# Altium project TugasAkhir.PrjPcb
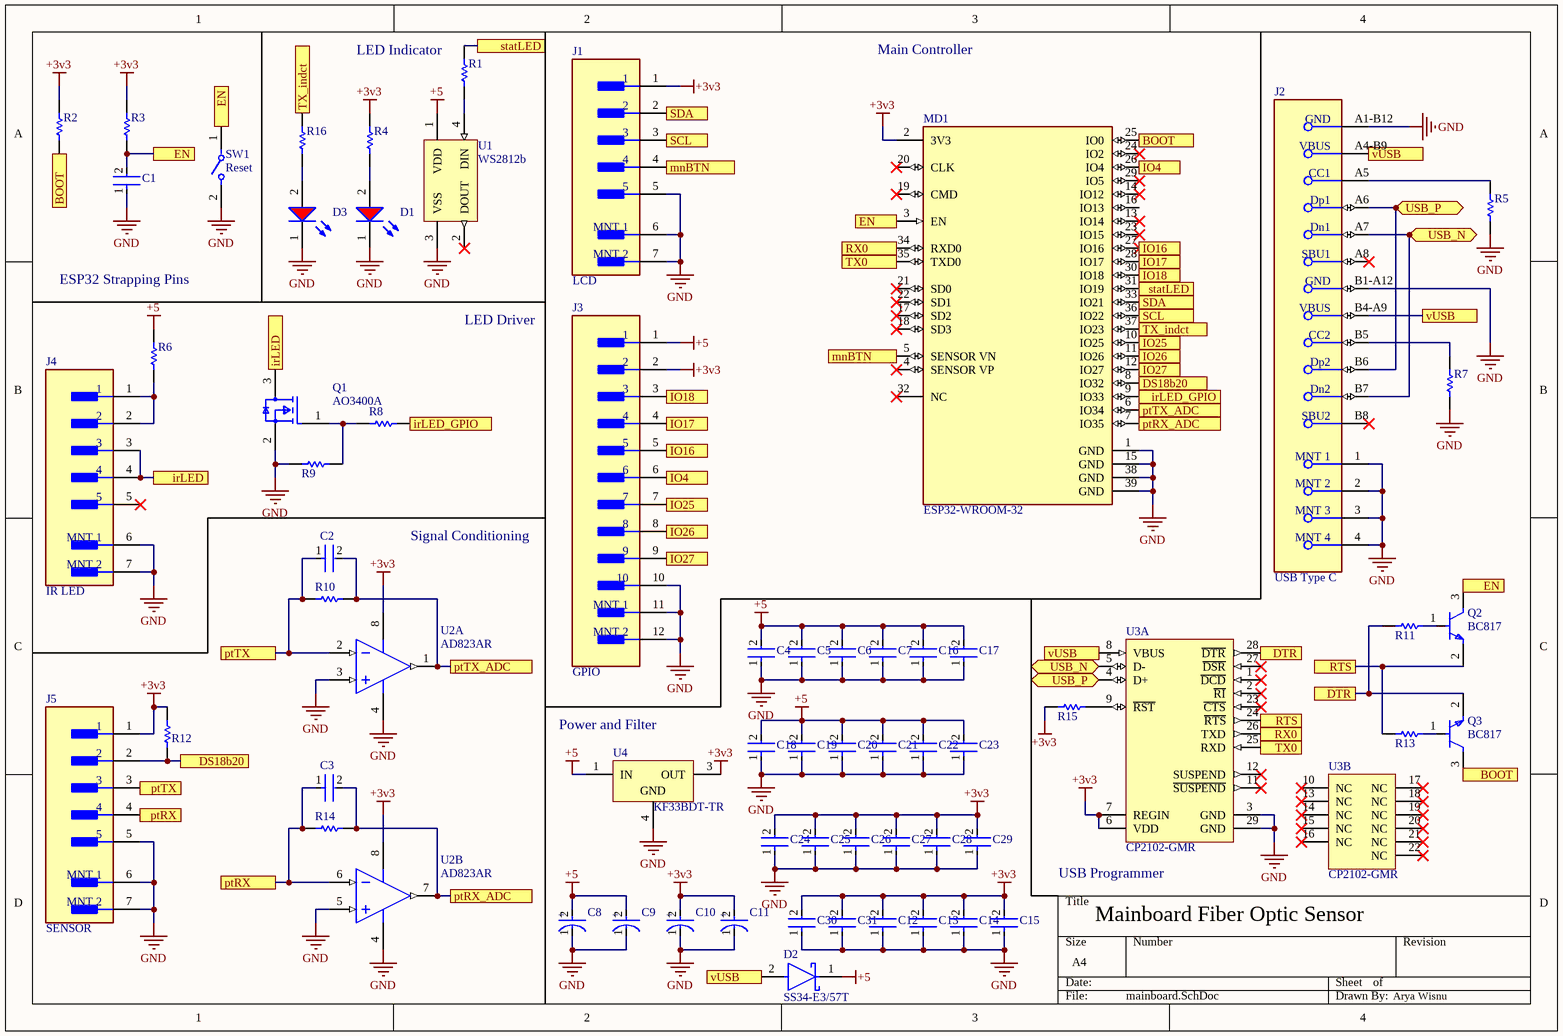
[diagram p0: mainboard.SchDoc]
1 sheet, 64 parts. Net scope: flat (ports and power ports of the same name join across sheets).
Board file: mainboard.PcbDoc

## Sheet mainboard.SchDoc
size A4; SheetNumber: 1; SheetTotal: 1

### Parts
C1  GRM21BR61E106KA73L  [FP-GRM21B-0_15-IPC_B]  (value not drawn)
C2  GRM21BR61E106KA73L  [FP-GRM21B-0_15-IPC_B]  (value not drawn)
C3  GRM21BR61E106KA73L  [FP-GRM21B-0_15-IPC_B]  (value not drawn)
C4  GRM21BR61E106KA73L  [FP-GRM21B-0_15-IPC_B]  (value not drawn)
C5  GRM21BR61E106KA73L  [FP-GRM21B-0_15-IPC_B]  (value not drawn)
C6  GRM21BR61E106KA73L  [FP-GRM21B-0_15-IPC_B]  (value not drawn)
C7  GRM21BR61E106KA73L  [FP-GRM21B-0_15-IPC_B]  (value not drawn)
C8  T491B106K016AT  [FP-T491B106K016AT-MFG]  (value not drawn)
C9  T491B106K016AT  [FP-T491B106K016AT-MFG]  (value not drawn)
C10  T491B106K016AT  [FP-T491B106K016AT-MFG]  (value not drawn)
C11  T491B106K016AT  [FP-T491B106K016AT-MFG]  (value not drawn)
C12  GRM21BR61E106KA73L  [FP-GRM21B-0_15-IPC_B]  (value not drawn)
C13  GRM21BR61E106KA73L  [FP-GRM21B-0_15-IPC_B]  (value not drawn)
C14  GRM21BR61E106KA73L  [FP-GRM21B-0_15-IPC_B]  (value not drawn)
C15  GRM21BR61E106KA73L  [FP-GRM21B-0_15-IPC_B]  (value not drawn)
C16  GRM21BR61E106KA73L  [FP-GRM21B-0_15-IPC_B]  (value not drawn)
C17  GRM21BR61E106KA73L  [FP-GRM21B-0_15-IPC_B]  (value not drawn)
C18  GRM21BR61E106KA73L  [FP-GRM21B-0_15-IPC_B]  (value not drawn)
C19  GRM21BR61E106KA73L  [FP-GRM21B-0_15-IPC_B]  (value not drawn)
C20  GRM21BR61E106KA73L  [FP-GRM21B-0_15-IPC_B]  (value not drawn)
C21  GRM21BR61E106KA73L  [FP-GRM21B-0_15-IPC_B]  (value not drawn)
C22  GRM21BR61E106KA73L  [FP-GRM21B-0_15-IPC_B]  (value not drawn)
C23  GRM21BR61E106KA73L  [FP-GRM21B-0_15-IPC_B]  (value not drawn)
C24  GRM21BR61E106KA73L  [FP-GRM21B-0_15-IPC_B]  (value not drawn)
C25  GRM21BR61E106KA73L  [FP-GRM21B-0_15-IPC_B]  (value not drawn)
C26  GRM21BR61E106KA73L  [FP-GRM21B-0_15-IPC_B]  (value not drawn)
C27  GRM21BR61E106KA73L  [FP-GRM21B-0_15-IPC_B]  (value not drawn)
C28  GRM21BR61E106KA73L  [FP-GRM21B-0_15-IPC_B]  (value not drawn)
C29  GRM21BR61E106KA73L  [FP-GRM21B-0_15-IPC_B]  (value not drawn)
C30  GRM21BR61E106KA73L  [FP-GRM21B-0_15-IPC_B]  (value not drawn)
C31  GRM21BR61E106KA73L  [FP-GRM21B-0_15-IPC_B]  (value not drawn)
D1  150080SS75000  [WL-SMCW_0805_150080xx75000]  (value not drawn)
D2  SS34-E3/57T  [FP-95402-MFG]
D3  150080SS75000  [WL-SMCW_0805_150080xx75000]  (value not drawn)
J1  LCD  [FP-SM05B-SRSS-G-TB_LF_SN-MFG]
J2  USB Type C  [FP-USB4105-GF-A-MFG]
J3  GPIO  [FP-BM10B-SRSS-TBT_LF_SN-MFG]
J4  IR LED  [FP-SM05B-SRSS-G-TB_LF_SN-MFG]
J5  SENSOR  [FP-SM05B-SRSS-G-TB_LF_SN-MFG]
MD1  ESP32-WROOM-32  [FP-ESP32-WROOM-32-MFG]
Q1  AO3400A  [FP-SOT23-MFG]
Q2  BC817  [FP-SOT23-MFG]
Q3  BC817  [FP-SOT23-MFG]
R1  ERA6AEB472V  [RESC2013X60X40ML20T25]  (value not drawn)
R2  ERA6AEB472V  [RESC2013X60X40ML20T25]  (value not drawn)
R3  ERA6AEB472V  [RESC2013X60X40ML20T25]  (value not drawn)
R4  ERA6AEB472V  [RESC2013X60X40ML20T25]  (value not drawn)
R5  ERA6AEB472V  [RESC2013X60X40ML20T25]  (value not drawn)
R6  ERA6AEB472V  [RESC2013X60X40ML20T25]  (value not drawn)
R7  ERA6AEB472V  [RESC2013X60X40ML20T25]  (value not drawn)
R8  ERA6AEB472V  [RESC2013X60X40ML20T25]  (value not drawn)
R9  ERA6AEB472V  [RESC2013X60X40ML20T25]  (value not drawn)
R10  ERA6AEB472V  [RESC2013X60X40ML20T25]  (value not drawn)
R11  ERA6AEB472V  [RESC2013X60X40ML20T25]  (value not drawn)
R12  ERA6AEB472V  [RESC2013X60X40ML20T25]  (value not drawn)
R13  ERA6AEB472V  [RESC2013X60X40ML20T25]  (value not drawn)
R14  ERA6AEB472V  [RESC2013X60X40ML20T25]  (value not drawn)
R15  ERA6AEB472V  [RESC2013X60X40ML20T25]  (value not drawn)
R16  ERA6AEB472V  [RESC2013X60X40ML20T25]  (value not drawn)
SW1  Reset  [FP-147873-1-MFG]
U1  WS2812b  [ADA-RGB-1655_V]
U2  AD823AR  [ADI-R-8_L]  (parts A,B of 2)
U3  CP2102-GMR  [SLAB-QFN-28-3125x3125TP_M]  (parts A,B of 2)
U4  KF33BDT-TR  [TO-252_M]

### Ports
BOOT, DS18b20, DTR, EN, IO4, IO16, IO17, IO18, IO25, IO26, IO27, irLED, irLED_GPIO, mnBTN, ptRX, ptRX_ADC, ptTX, ptTX_ADC, RTS, RX0, SCL, SDA, statLED, TX0, TX_indct, USB_N (bidir), USB_P (bidir), vUSB

### Nets
+3v3: C10.2(A) C11.2(A) C12.2 C13.2 C14.2 C15.2 C24.2 C25.2 C26.2 C27.2 C28.2 C29.2 C30.2 C31.2 J1.1 J3.2 J5.1 MD1.2(3V3) R2.2 R3.2 R4.2 R12.2 R15.1 U2.8(+VS) U3.6(VDD) U3.7(REGIN) U4.3(OUT)
+5: C4.2 C5.2 C6.2 C7.2 C8.2(A) C9.2(A) C16.2 C17.2 C18.2 C19.2 C20.2 C21.2 C22.2 C23.2 D2.1(C) J3.1 R6.2 U1.1(VDD) U4.1(IN)
GND: C1.1 C4.1 C5.1 C6.1 C7.1 C8.1(C) C9.1(C) C10.1(C) C11.1(C) C12.1 C13.1 C14.1 C15.1 C16.1 C17.1 C18.1 C19.1 C20.1 C21.1 C22.1 C23.1 C24.1 C25.1 C26.1 C27.1 C28.1 C29.1 C30.1 C31.1 D1.1(K) D3.1(K) J1.5 J1.6(MNT_1) J1.7(MNT_2) J2.1(MNT_1) J2.2(MNT_2) J2.3(MNT_3) J2.4(MNT_4) J2.A1-B12(GND) J2.B1-A12(GND) J3.10 J3.11(MNT_1) J3.12(MNT_2) J4.6(MNT_1) J4.7(MNT_2) J5.5 J5.6(MNT_1) J5.7(MNT_2) MD1.1(GND) MD1.15(GND) MD1.38(GND) MD1.39(GND) Q1.2(S) R5.1 R7.1 R9.2 SW1.2 U1.3(VSS) U2.3(+IN_1) U2.4(-VS) U2.5(+IN_2) U3.3(GND) U3.29(GND) U4.4(GND)
NetC1_2: C1.2 MD1.3(EN) Q2.3(C) R3.1 SW1.1 ; port EN
NetC2_1: C2.1 J5.3 R10.1 U2.2(-IN_1) ; port ptTX
NetC2_2: C2.2 MD1.6(IO34) R10.2 U2.1(OUT_1) ; port ptTX_ADC
NetC3_1: C3.1 J5.4 R14.1 U2.6(-IN_2) ; port ptRX
NetC3_2: C3.2 MD1.7(IO35) R14.2 U2.7(OUT_2) ; port ptRX_ADC
NetD1_2: D1.2(A) R4.1
NetD2_2: D2.2(A) J2.A4-B9(VBUS) J2.B4-A9(VBUS) U3.8(VBUS) ; port vUSB
NetD3_2: D3.2(A) R16.1
NetJ1_2: J1.2 MD1.33(IO21) ; port SDA
NetJ1_3: J1.3 MD1.36(IO22) ; port SCL
NetJ1_4: J1.4 MD1.5(SENSOR_VN) ; port mnBTN
NetJ2_A5: J2.A5(CC1) R5.2
NetJ2_A6: J2.A6(Dp1) J2.B6(Dp2) U3.4(D+) ; port USB_P
NetJ2_A7: J2.A7(Dn1) J2.B7(Dn2) U3.5(D-) ; port USB_N
NetJ2_B5: J2.B5(CC2) R7.2
NetJ3_3: J3.3 MD1.30(IO18) ; port IO18
NetJ3_4: J3.4 MD1.28(IO17) ; port IO17
NetJ3_5: J3.5 MD1.27(IO16) ; port IO16
NetJ3_6: J3.6 MD1.26(IO4) ; port IO4
NetJ3_7: J3.7 MD1.10(IO25) ; port IO25
NetJ3_8: J3.8 MD1.11(IO26) ; port IO26
NetJ3_9: J3.9 MD1.12(IO27) ; port IO27
NetJ4_1: J4.1 J4.2 R6.1
NetJ4_3: J4.3 J4.4 Q1.3(D) ; port irLED
NetJ5_2: J5.2 MD1.8(IO32) R12.1 ; port DS18b20
NetMD1_9: MD1.9(IO33) R8.2 ; port irLED_GPIO
NetMD1_25: MD1.25(IO0) Q3.3(C) R2.1 ; port BOOT
NetMD1_31: MD1.31(IO19) R1.2 ; port statLED
NetMD1_34: MD1.34(RXD0) U3.26(TXD) ; port RX0
NetMD1_35: MD1.35(TXD0) U3.25(RXD) ; port TX0
NetMD1_37: MD1.37(IO23) R16.2 ; port TX_indct
NetQ1_1: Q1.1(G) R8.1 R9.1
NetQ2_1: Q2.1(B) R11.1
NetQ2_2: Q2.2(E) R13.2 U3.24(~{RTS}) ; port RTS
NetQ3_1: Q3.1(B) R13.1
NetQ3_2: Q3.2(E) R11.2 U3.28(~{DTR}) ; port DTR
NetR1_1: R1.1 U1.4(DIN)
NetR15_2: R15.2 U3.9(~{RST})

Not connected (* = marked no-connect by the designer): J2 A8(SBU1)* B8(SBU2)*; J4 5*; MD1 4(SENSOR_VP)* 13(IO14)* 14(IO12)* 16(IO13) 17(SD2)* 18(SD3)* 19(CMD)* 20(CLK)* 21(SD0)* 22(SD1)* 23(IO15)* 24(IO2)* 29(IO5)* 32(NC)*; U1 2(DOUT)*; U3 1(~{DCD})* 2(~{RI})* 10(NC)* 11(~{SUSPEND})* 12(SUSPEND)* 13(NC)* 14(NC)* 15(NC)* 16(NC)* 17(NC)* 18(NC)* 19(NC)* 20(NC)* 21(NC)* 22(NC)* 23(~{CTS})* 27(~{DSR})*

### Notes on the sheet
- (near R1) LED Indicator
- Main Controller
- ESP32 Strapping Pins
- LED Driver
- Signal Conditioning
- (near U4) Power and Filter
- (near U3) USB Programmer
- (near U3) Mainboard Fiber Optic Sensor
- Arya Wisnu
- (in symbol CMP-03017-000012-1) +

### Library data of the parts
C1-C7 C12-C31 = CMP-2007-03541-2: Chip Multilayer Ceramic Capacitors for General Purpose, 0805, 10uF, X5R, 15%, 10%, 25V; Length: 2mm; Depth: 1.25mm; Termination: SMD/SMT; Voltage: 25V; Height: 1.25mm; Material: Ceramic; Thickness: 0.053inch; Radiation Hardening: No; Min Operating Temperature: -55°C; Width: 0.049inch; Package Quantity: 1; Mount: Surface Mount; Dielectric: X5R; Packaging: Tape and Reel; Capacitance: 10uF; Voltage Rating (DC): 25V; Lead Free: Lead Free; Max Operating Temperature: 85°C; Case Code (Imperial): 0805; Case/Package: 0805; Tolerance: 10%; Voltage Rating: 25V; Case Code (Metric): 2012
C8-C11 = CMP-03017-000012-1: CAP TANT 10UF 10% 16V 1411; Dissipation Factor: 6%; ESR (Equivalent Series Resistance): 2.8R; Ripple Current: 174mA; Dielectric Material: Tantalum; Leakage Current: 1.6uA; Polarity: Polar; Life (Hours): 2000Hour; Case/Package: 1411; Height - Seated (Max): 0.083inch; Case Code (Metric): 3528; Height: 1.9mm; Packaging: Tape and Reel; RoHS Compliant: Yes; Voltage Rating (DC): 16V; Tolerance: 10%; Lead Pitch: 1.9mm; Min Operating Temperature: -55°C; Package Quantity: 1; Capacitance: 10uF; Mount: Surface Mount; Length: 3.5mm; Max Operating Temperature: 125°C; Number of Pins: 2; Voltage: 16V; Voltage Rating: 16V; Termination: SMD/SMT; Depth: 2.8mm; Lead Free: Lead Free; REACH SVHC: No SVHC; Case Code (Imperial): 1411; Width: 0.11inch; Features: General Purpose
D1 D3 = CMP-1426-00010-3: NexarPartId: 29717782; Peak Wavelength: 645nm; Luminous Intensity: 60mcd; Max Junction Temperature (Tj): 95°C; Wavelength: 630nm; Forward Current: 100mA; Max Reverse Voltage (DC): 5V; Color: Red; Lens Style: Clear, Rectangular; Test Current: 20mA; Power Dissipation: 72mW; Viewing Angle: 140°; Forward Voltage: 1.9V; Case Code (Metric): 2012; Max Operating Temperature: 85°C; Mount: Surface Mount; Height: 700µm; Case/Package: 0805; Min Operating Temperature: -40°C; Reverse Voltage: 5V; RoHS: Compliant; Packaging: Tape and Reel; REACH SVHC: Unknown; Case Code (Imperial): 0805; Length: 2mm; Width: 1.25mm; Dominant Wavelength: 630nm
D2 = CMP-02539-000012-1: DIODE SCHOTTKY 40V 3A DO214AB; Manufacturer: Vishay; Max Junction Temp: +150°C; Peak Reverse Current: 0.5mA; Max Surge Forward Current: 100A; Standoff Height: 0mm; ComponentLink2Description: Datasheet; Device Class L3: Schottky Diodes; Height: 2.62mm; Max Repetitive Reverse Voltage: 40V; Lead Free: Yes; Package: 95402; Temperature Range High: +150°C; ComponentLink2URL: http://www.vishay.com/docs/88751/ss32.pdf; Temperature: -55°C to +150°C; Footprint Url: http://www.vishay.com/docs/95402/smc.pdf; Automotive: No; Forward Current: 3A; Category: Diode; Manufacturer Part Number: SS34-E3/57T; RoHS: TRUE; Device Class L2: Diodes; Mouser Description: Schottky Diodes & Rectifiers 3.0 Amp 40 Volt; Octopart: https://octopart.com/ss34-e3%2F57t-vishay-39552907; Temperature Range Low: -55°C; Device Class L1: Discrete Semiconductors; Digikey Description: DIODE SCHOTTKY 40V 3A DO214AB
J1 J4 J5 = CMP-17439-000344-1: CONN HEADER SMD R/A 5POS 1MM; Connector Type: Male Pin; Pitch: 0.039inch; Number of Positions: 5; Lead Free: Lead Free; Contact Plating: Tin; Mount: Surface Mount; Number of Pins: 5; Contact Type: Male Pin; Packaging: Tape and Reel; Number of Rows: 1; Termination: Solder; Series: SR
J2 = CMP-245163-000001-1: CONN RCPT USB2.0 TYPEC 5A; Manufacturer Part Number: USB4105-GF-A; Manufacturer: GCT; Voltage Rating: 20V; Is Female: yes; Current Rating: 5/6.25/1.25/0.25A; Number Of Contacts: 16; Conn Orientation: Right Angle; Device Class L1: Connectors; Category: Conn; Lead Free: Yes; RoHS: TRUE; Temperature Range High: +85°C; Digikey Description: CONN RCPT USB2.0 TYPEC 5A; Device Class L3: unset; ComponentLink2Description: Datasheet; Package: 0; Usb Standard: USB 2.0; Device Class L2: USB Connectors; Automotive: No; Temperature Range Low: -40°C; Height: 3.46mm; Temperature: -40°C to +85°C; Contact Material: Gold,Nickel; ComponentLink2URL: https://gct.co/files/drawings/usb4105.pdf; Octopart: https://octopart.com/usb4105-gf-a-gct-106627878
J3 = CMP-17439-000586-1: CONN HEADER SMD 10POS 1MM; Number of Positions: 10; Lead Free: Lead Free; Pitch: 1mm; Termination: Crimp
MD1 = CMP-194065-000008-1: RX TXRX MOD WIFI SURFACE MOUNT; Frequency: 2.5GHz; Sensitivity: -98dBm; Operating Supply Voltage: 3.6V; Data Rate: 150Mbps; Weight: 0.088185oz; Package Quantity: 550; Min Operating Temperature: -40°C; Mount: Surface Mount; Max Operating Temperature: 85°C; Packaging: Cut Tape; Case/Package: SMD/SMT
Q1 = CMP-83955-000006-1: MOSFET N-CH 30V 5.7A SOT23; Input Capacitance: 630pF; Number of Elements: 1; Rds On Max: 26.5mR; Max Power Dissipation: 1.4W; Gate to Source Voltage (Vgs): 12V; Min Operating Temperature: -55°C; Lead Free: Lead Free; Number of Pins: 3; Drain to Source Voltage (Vdss): 30V; Case/Package: SOT-23; Mount: Surface Mount; Continuous Drain Current (ID): 5.7A; Radiation Hardening: No; Packaging: Tape and Reel; Max Operating Temperature: 150°C; Power Dissipation: 1.4W
Q2 Q3 = CMP-14406-000007-1: TRANS NPN 45V 0.5A SOT23; Manufacturer Part Number: BC817-40,215; Manufacturer: Nexperia; Collector Emitter Saturation Voltage: 700mV; Power Dissipation: 250mW; Collector Base Voltage: 50V; Unity Gain Freq: 100MHz; Hfe Max: 600; Rthja Max: 500K/W; Emitter Base Voltage: 5V; Max Collector Current: 500mA; Hfe Testvce: 1V; Automotive Grade: Grade 0; Hfe Min: 250; Max Junction Temp: +150°C; Number Of Npn: 1; Hfe Testic: 100mA; Octopart: https://octopart.com/bc817-40%2C215-nexperia-78739081; Lead Free: Yes; Ipc Land Pattern Name: SOT95P230X100-3; RoHS: TRUE; Collector Emitter Breakdown Voltage: 45V; Digikey Description: TRANS NPN 45V 0.5A SOT23; ComponentLink2URL: https://assets.nexperia.com/documents/data-sheet/BC817_SER.pdf; Temperature Range High: +150°C; Mouser Description: BC817 Series 45 V 500 mA 250 mW SMT NPN General-Purpose Transistor - SOT-23-; Device Class L3: BJTs; Temperature: to +150°C; Height: 1.1mm; Automotive: Yes; Ambient Temperature Range Low: -65°C; Package: SOT23; Collector Emitter Voltage: 45V; Category: Trans; ComponentLink2Description: Datasheet; Device Class L2: Transistors; Ambient Temperature Range High: +150°C; Number Of Elements: 1; Device Class L1: Discrete Semiconductors; Footprint Url: https://assets.nexperia.com/documents/outline-drawing/SOT23.pdf
R1 R4 R16 = CMP-2001-00644-1: 330ohm; Manufacturer: Panasonic; Part Number: ERA6AEB472V
R2 R3 R9 R11 R13 = CMP-2001-00644-1: 10k; Manufacturer: Panasonic; Part Number: ERA6AEB472V
R5 R7 = CMP-2001-00644-1: 5k1; Manufacturer: Panasonic; Part Number: ERA6AEB472V
R6 = CMP-2001-00644-1: Manufacturer: Panasonic; Part Number: ERA6AEB472V
R8 = CMP-2001-00644-1: 100ohm; Manufacturer: Panasonic; Part Number: ERA6AEB472V
R10 R14 = CMP-2001-00644-1: 50k; Manufacturer: Panasonic; Part Number: ERA6AEB472V
R12 R15 = CMP-2001-00644-1: 4k7; Manufacturer: Panasonic; Part Number: ERA6AEB472V
SW1 = CMP-03407-000005-1: SWITCH TACTILE SPST-NO 0.05A 24V; Manufacturer: TE Connectivity; Manufacturer Part Number: 147873-1; Contact Resistance: 100mΩ; Operating Force: 180gf; Electromechanical Life: 40000Cycles; Contact Current Rating: 50mA; Throw Configuration: SPST-NO; Mouser Description: Switch Tactile OFF (ON) SPST Rectangular Button J-Bend 0.05A 24VDC 1.77N SMD T/R; Mount: Surface Mount; Height: 5.5mm; Category: Switch; RoHS: TRUE; Temperature Range High: +85°C; ComponentLink2Description: Datasheet; Temperature Range Low: -35°C; Device Class L1: Electromechanical; Device Class L2: Switches; Package: 0; Temperature: -35°C to +85°C; Device Class L3: Tactile Switches; Automotive: No; ComponentLink2URL: https://www.te.com/commerce/DocumentDelivery/DDEController?Action=showdoc&DocId=Customer+Drawing%7F147873%7FK3%7Fpdf%7FEnglish%7FENG_CD_147873_K3.pdf%7F147873-1; Lead Free: Yes; Voltage Rating Dc: 24V; Octopart: https://octopart.com/147873-1-te+connectivity-40818451; Digikey Description: SWITCH TACTILE SPST-NO 0.05A 24V
U1 = CMP-2000-05026-1: Intelligent Control LED Integrated Light Source, 3.5 to 5.3 V, -25 to 80 degC, 4-Pin SMD, RoHS, Tape and Reel; Manufacturer: Adafruit-Industries-LLC; Number of LEDs: 10; Configuration: Discrete; Utilized LED: WS2812(5050); Datasheet URL: http://datasheet.octopart.com/ADA1655-Adafruit-Industries-datasheet-32028139.pdf; Series: Neopixel; Interface: -; Package Description: 4-Pin Surface Mount Device, Body 5 x 5 mm; Color: Red,Green,Blue(RGB); Category: Optoelectronics; Controller Type: -; Package Reference: 1655; Manufacturer URL: https://www.adafruit.com/; Mounting Type: SurfaceMount; Datasheet Version: May-13; Size / Dimension: 5.00mmLx5.00mmW; Family: Addressable,Specialty
U2 = CMP-0384-00939-1: Double Channel Rail-to-Rail Operational Amplifier, 16 MHz BW, 25 V/us SR, Industrial, 8-pin SOIC (R-8), Tube; Manufacturer: Analog Devices; Generic Part Number: AD823; V Span Max: 36V; Slew Rate: 25V/us; Small Signal Bandwidth: 16MHz; Amplifiers Per Package: 2; Input Bias Current: 5pA; Input Offset Voltage: 700uV; V Span Min: 3V; Iq/Amp: 4.2mA; ComponentLink1URL: http://www.analog.com/en/index.html; PartNumber: AD823AR; PackageReference: R-8; PackageVersion: 060506-A; PackageDescription: 8-Pin Standard Small Outline Package, Body 3.9 x 4.9 mm, Pitch 1.27 mm; ComponentLink2URL: http://www.analog.com/static/imported-files/data_sheets/AD823.pdf; Code_JEDEC: MS-012-AA; ComponentLink3Description: Package Specification; DatasheetVersion: Rev. E; Mounting Technology: Surface Mount; ComponentLink1Description: Manufacturer URL; ComponentLink3URL: http://www.analog.com/static/imported-files/packages/PKG_PDF/SOIC_Narrow%20(R)/R_8.pdf; ComponentLink2Description: Datasheet
U3 = CMP-2000-04924-1: Single-Chip USB to URAT Bridge, 3.3 V, -40 to 85 degC, 28-Pin QFN, RoHS, Tape and Reel; Manufacturer: Silicon Labs; Interface Circuit Standard 1: RS-232; Transmitter and Receiver FIFO Counter: No; Supply Current: 26mA; Operating Supply Voltage (Min): 3V; Operating Supply Voltage (Typ): 3.3V; Data Rate: 1000kbps; Operating Supply Voltage (Max): 3.6V; Number of Channels: 1; Package URL: http://www.silabs.com/Support%20Documents/TechnicalDocs/C8051T61x.pdf; Operating Temperature (Max): 85C; Datasheet URL: http://www.mouser.com/ds/2/368/CP2102-9-247052.pdf; Operating Temperature Classification: Industrial; Operating Temperature (Min): -40C; Package Description: 28-Pin Quad-Flat No-Leads Package, Body 5 x 5 mm, Pitch 0.5 mm; Manufacturer URL: http://www.silabs.com/; Rad Hardened: No; Package Reference: QFN-28; Pin Count: 28; Packaging: TapeandReel; Mounting: SurfaceMount; Package Type: QFNEP; Datasheet Version: Rev. 1.6, 12/2013
U4 = CMP-0244-00072-1: Very Low Drop Voltage Regulators with Inhibit, 3.3V, 3-Pin DPAK, Tape and Reel; DatasheetVersion: 21/02/2008; ComponentLink2Description: Datasheet; ComponentLink1URL: http://www.st.com; PackageVersion: 2011; ComponentLink1Description: Manufacturer URL; PackageDescription: 3-Pin Transistor Outline Package 2.28 mm Pitch, 9.7 mm Lead Span (DPAK); ComponentLink2URL: http://www.st.com/internet/com/TECHNICAL_RESOURCES/TECHNICAL_LITERATURE/DATASHEET/CD00000970.pdf; PackageReference: TO-252